# EAGLE design micro-lrs (EAGLE 7.2.0)
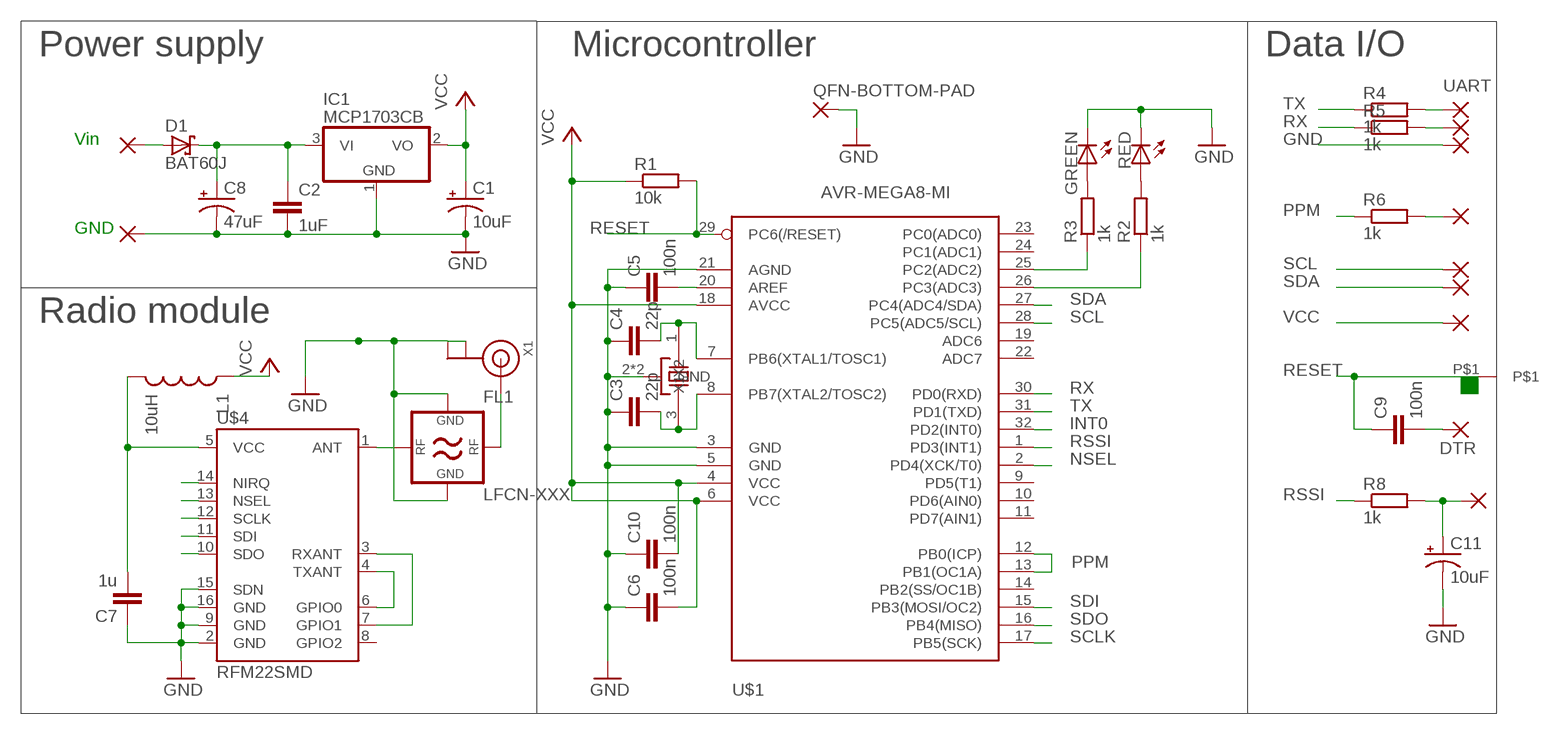
[diagram p0: schematic, sheet 1]

## Parts
+5V  SMD2  [SMD1,27-2,54]
C1  10uF  CAP_POL1206  [EIA3216]
C2  1uF  C-EUC0805K  [C0805K]
C3  22p  C-EUC0603K  [C0603K]
C4  22p  C-EUC0603K  [C0603K]
C5  100n  C-EUC0603K  [C0603K]
C6  100n  C-EUC0603K  [C0603K]
C7  1u  C-EUC0805K  [C0805K]
C8  47uF  CAP_POL3528  [EIA3528]
C9  100n  C-EUC0603K  [C0603K]
C10  100n  C-EUC0603K  [C0603K]
C11  10uF  CAP_POL1206  [EIA3216]
D1  BAT60J  [SOD323_ST]
DTR  SMD2  [SMD1,27-2,54]
FL1  LFCN-XXX  [FV1206]
GND  SMD2  [SMD1,27-2,54]
IC1  MCP1703CB  [SOT23]
L1  10uH  INDUCTOR0805  [0805]
LED1  GREEN  LEDCHIPLED_0603  [CHIPLED_0603]
LED2  RED  LEDCHIPLED_0603  [CHIPLED_0603]
PPM  SMD2  [SMD1,27-2,54]
PPM1  SMD2  [SMD1,27-2,54]
QFN-BOTTOM-PAD  QFN-PAD  [SMD100X100]
R1  10k  R-EU_R0603  [R0603]
R2  1k  R-EU_R0603  [R0603]
R3  1k  R-EU_R0603  [R0603]
R4  1k  R-EU_R0603  [R0603]
R5  1k  R-EU_R0603  [R0603]
R6  1k  R-EU_R0603  [R0603]
R8  1k  R-EU_R0603  [R0603]
RSSI  SMD2  [SMD1,27-2,54]
RX  SMD2  [SMD1,27-2,54]
SCL  SMD2  [SMD1,27-2,54]
SDA  SMD2  [SMD1,27-2,54]
TX  SMD2  [SMD1,27-2,54]
U$1  AVR-MEGA8-MI  [MLF32]
U$2  CTS_32X25_SMD  [CTS_32X25]
U$3  PAD75X60  [PAD75X60]
U$4  RFM22SMD  [RFM22-XXX-S2]
UART-GND  SMD2  [SMD1,27-2,54]
X1  ANTENNA_U.FL  [U.FL]

## Nets
ANT-PAD: FL1.1(IO1) U$4.1(ANT)
AREF: C5.2 U$1.20(AREF)
DTR: C9.2 DTR.1(P)
GND: C1.C(-) C2.2 C3.1 C4.1 C5.1 C6.1 C7.1 C8.C(-) C10.1 C11.C(-) FL1.3(GND2) FL1.4(GND1) GND.1(P) IC1.1(GND) LED1.C LED2.C QFN-BOTTOM-PAD.P$2(P) U$1.3(GND) U$1.5(GND) U$1.21(AGND) U$4.2(GND) U$4.9(GND) U$4.15(SDN) U$4.16(GND) UART-GND.1(P) X1.1(GND) X1.2(GND)
INT0: U$1.32(PD2(INT0)) U$4.14(NIRQ)
N$2: C4.2 U$1.7(PB6(XTAL1/TOSC1)) U$2.1(X1)
N$3: C3.2 U$1.8(PB7(XTAL2/TOSC2)) U$2.3(X2)
N$4: R3.1 U$1.25(PC2(ADC2))
N$5: R2.1 U$1.26(PC3(ADC3))
N$7: LED1.A R3.2
N$8: LED2.A R2.2
N$12: FL1.2(IO2) X1.3(SIGNAL)
N$16: U$4.4(TXANT) U$4.6(GPIO0)
N$17: U$4.3(RXANT) U$4.7(GPIO1)
NSEL: U$1.2(PD4(XCK/T0)) U$4.13(NSEL)
PPM: R6.1 U$1.12(PB0(ICP)) U$1.13(PB1(OC1A))
PPMPAD: PPM.1(P) R6.2
RESET: C9.1 R1.2 U$1.29(PC6(/RESET)) U$3.P$1
RSSI: R8.1 U$1.1(PD3(INT1))
RSSIPAD: C11.A(+) R8.2 RSSI.1(P)
RX: R5.1 U$1.30(PD0(RXD))
RXPAD: R5.2 RX.1(P)
SCL: SCL.1(P) U$1.28(PC5(ADC5/SCL))
SCLK: U$1.17(PB5(SCK)) U$4.12(SCLK)
SDA: SDA.1(P) U$1.27(PC4(ADC4/SDA))
SDI: U$1.15(PB3(MOSI/OC2)) U$4.11(SDI)
SDO: U$1.16(PB4(MISO)) U$4.10(SDO)
TX: R4.1 U$1.31(PD1(TXD))
TXPAD: R4.2 TX.1(P)
VCC: C1.A(+) C6.2 C10.2 IC1.2(VO) L1.1 PPM1.1(P) R1.1 U$1.4(VCC) U$1.6(VCC) U$1.18(AVCC)
VCC-RADIO: C7.2 L1.2 U$4.5(VCC)
VIN: C2.1 C8.A(+) D1.C IC1.3(VI)
VIN-BEFORE-DIODE: +5V.1(P) D1.A
Unconnected: U$1.9(PD5(T1)) U$1.10(PD6(AIN0)) U$1.11(PD7(AIN1)) U$1.14(PB2(SS/OC1B)) U$1.19(ADC6) U$1.22(ADC7) U$1.23(PC0(ADC0)) U$1.24(PC1(ADC1)) U$4.8(GPIO2)

## Notes on the sheet
- Power supply | Microcontroller | Data I/O
- UART
- Vin
- GND
- Radio module

## Power pins joined to a net without a drawn wire
GND: U$2.2(GND) U$2.4(GND)

## Library data of the parts
+5V DTR GND PPM PPM1 RSSI RX SCL SDA TX UART-GND = wirepad:SMD2: SMD PAD
C1 C8 C11 = SparkFun:CAP_POL: Capacitor Polarized These are standard SMD and PTH capacitors. Normally 10uF, 47uF, and 100uF in electrolytic and tantalum varieties. Always verify the external diameter of the through hole cap, it varies with capacity, voltage, and manufacturer. The EIA devices should be standard.
C2-C7 C9 C10 = resistor:C-EU: CAPACITOR, European symbol
D1 = diode:BAT60J: Schottky barrier diode Source: www.st.com, BAT60J.pdf
FL1 = mini-circuits:LFCN-XXX: CERAMIC LOW PASS FILTER
IC1 = linear:MCP1703: 250 mA, 16V, Low Quiescent Current LDO Regulator Source: http://ww1.microchip.com/downloads/en/DeviceDoc/22049b.pdf
L1 = SparkFun:INDUCTOR: Inductors Basic Inductor/Choke - 0603 and 1206. Footprints are not proven and vary greatly between part numbers.
LED1 LED2 = led:LED: LED OSRAM: - CHIPLED LG R971, LG N971, LY N971, LG Q971, LY Q971, LO R971, LY R971 LH N974, LH R974 LS Q976, LO Q976, LY Q976 LO Q996 - Hyper CHIPLED LW Q18S LB Q993, LB Q99A, LB R99A - SideLED LS A670, LO A670, LY A670, LG A670, LP A670 LB A673, LV A673, LT A673, LW A673 LH A674 LY A675 LS A676, LA A676, LO A676, LY A676, LW A676 LS A679, LY A679, LG A679 - Hyper Micro SIDELED® LS Y876, LA Y876, LO Y876, LY Y876 LT Y87S - SmartLED LW L88C, LW L88S LB L89C, LB L89S, LG L890 LS L89K, LO L89K, LY L89K LS L896, LA L896, LO L896, LY L896 - TOPLED LS T670, LO T670, LY T670, LG T670, LP T670 LSG T670, LSP T670, LSY T670, LOP T670, LYG T670 LG T671, LOG T671, LSG T671 LB T673, LV T673, LT T673, LW T673 LH T674 LS T676, LA T676, LO T676, LY T676, LB T676, LH T676, LSB T676, LW T676 LB T67C, LV T67C, LT T67C, LS T67K, LO T67K, LY T67K, LW E67C LS E67B, LA E67B, LO E67B, LY E67B, LB E67C, LV E67C, LT E67C LW T67C LS T679, LY T679, LG T679 LS T770, LO T770, LY T770, LG T770, LP T770 LB T773, LV T773, LT T773, LW T773 LH T774 LS E675, LA E675, LY E675, LS T675 LS T776, LA T776, LO T776, LY T776, LB T776 LHGB T686 LT T68C, LB T68C - Hyper Mini TOPLED® LB M676 - Mini TOPLED Santana® LG M470 LS M47K, LO M47K, LY M47K Source: http://www.osram.convergy.de - LUMILED® LXK2-PW12-R00, LXK2-PW12-S00, LXK2-PW14-U00, LXK2-PW14-V00 LXK2-PM12-R00, LXK2-PM12-S00, LXK2-PM14-U00 LXK2-PE12-Q00, LXK2-PE12-R00, LXK2-PE12-S00, LXK2-PE14-T00, LXK2-PE14-U00 LXK2-PB12-K00, LXK2-PB12-L00, LXK2-PB12-M00, LXK2-PB14-N00, LXK2-PB14-P00, LXK2-PB14-Q00 LXK2-PR12-L00, LXK2-PR12-M00, LXK2-PR14-Q00, LXK2-PR14-R00 LXK2-PD12-Q00, LXK2-PD12-R00, LXK2-PD12-S00 LXK2-PH12-R00, LXK2-PH12-S00 LXK2-PL12-P00, LXK2-PL12-Q00, LXK2-PL12-R00 Source: www.luxeon.com
QFN-BOTTOM-PAD = wirepad2:QFN-PAD: SMD PAD
R1-R6 R8 = resistor:R-EU_: RESISTOR, European symbol
U$1 = SparkFun:AVR-MEGA8: MICROCONTROLLER 8 Kbytes FLASH 1 kbytes SRAM 512 bytes EEPROM USART 6-channel 10 bit ADC 2-channel 8 bit ADC
U$2 = cts_crystal:CTS_32X25_SMD
U$3 = moje-pady:PAD75X60
U$4 = SparkFun-RF:RFM22: The RFM22 is a low-power, low cost radio that is capable of operating in the 434MHz and 900MHz open bands. It's frequency is software defined and there are some very good libraries written for it.
X1 = adafruit:ANTENNA_U.FL: U.FL Antenna Connector

## Board
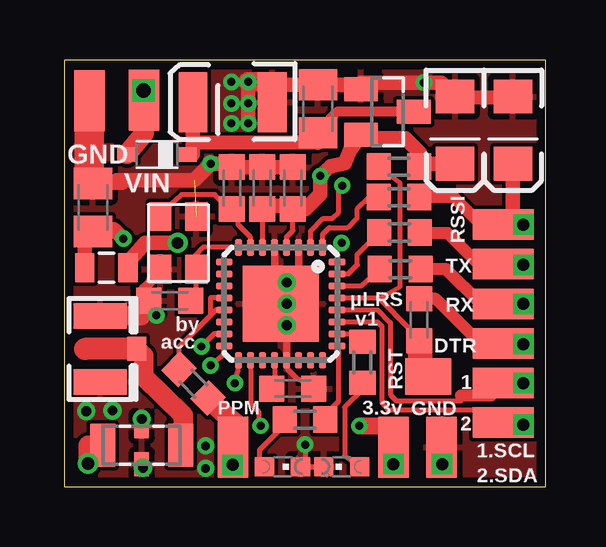
[diagram p1: board, top side]
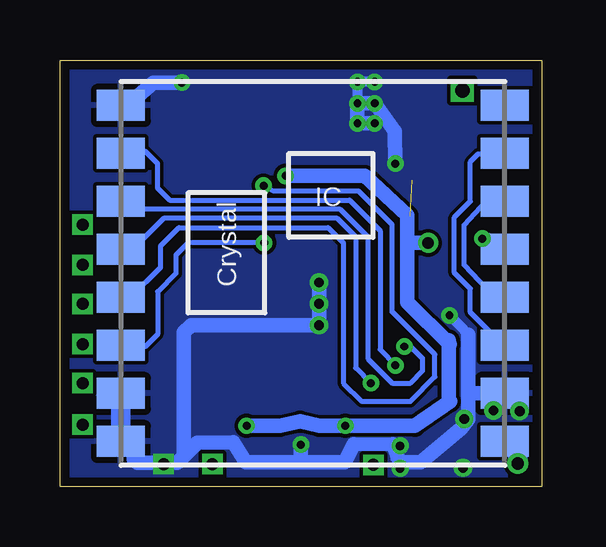
[diagram p2: board, bottom side, seen from below]

Size 20.07 x 17.78 mm. Coordinates in mm from the lower left corner, seen from the top.
Outline: 0,0 20.07,0 20.07,17.78 0,17.78 0,0
Copper layers (1*16): Top 0.0356mm / dielectric 1.5011mm / Bottom 0.0356mm
Design rules "oshpark-design-rules *": minimum track width 6mil, minimum drill 13mil, track to track 6mil, track to pad 6mil, pad to pad 6mil, via to via 6mil, smd to smd 6mil, copper to edge 15mil, drill to drill 6mil, minimum pad ring 7mil, minimum via ring 7mil, stop-mask expansion 3mil, vias tented up to drill 25mil, thermal gap 10mil

### Footprints (pad centres in the part's own frame; a part is rotated, then mirrored left to right if it is on the bottom)
SMD1,27-2,54 = smd 1.27 x 2.54: 1 0,0
EIA3216 = smd 1.4 x 1.6: A 1.4,0; C -1.4,0
C0805K = smd 1.3 x 1.6: 1 -1,0; 2 1,0
C0603K = smd 1.05 x 1.08: 1 -0.875,0; 2 0.875,0
EIA3528 = smd 1.2 x 2.5: A 1.65,0; C -1.65,0
SOD323_ST = smd 0.8 x 0.6: A 1.25,0; C -1.25,0
FV1206 = smd 1.04 x 1.8: 1 -1.625,0; 2 1.625,0 | smd 0.6 x 1: 3 0,0.8; 4 0,-0.8
SOT23 = smd 1 x 1.4: 1 -0.95,-1.1; 2 0.95,-1.1; 3 0,1.1
0805 = smd 0.8 x 1.2: 1 -0.9,0; 2 0.9,0
CHIPLED_0603 = smd 0.8 x 0.8: A 0,-0.75; C 0,0.75
SMD100X100 = smd 3.175 x 3.175: P$2 0,0
R0603 = smd 1 x 1.1: 1 -0.85,0; 2 0.85,0
MLF32 = smd 0.7 x 0.3: 1 -2.35,1.75; 2 -2.35,1.25; 3 -2.35,0.75; 4 -2.35,0.25; 5 -2.35,-0.25; 6 -2.35,-0.75; 7 -2.35,-1.25; 8 -2.35,-1.75; 17 2.35,-1.75; 18 2.35,-1.25; 19 2.35,-0.75; 20 2.35,-0.25; 21 2.35,0.25; 22 2.35,0.75; 23 2.35,1.25; 24 2.35,1.75 | smd 0.3 x 0.7: 9 -1.75,-2.35; 10 -1.25,-2.35; 11 -0.75,-2.35; 12 -0.25,-2.35; 13 0.25,-2.35; 14 0.75,-2.35; 15 1.25,-2.35; 16 1.75,-2.35; 25 1.75,2.35; 26 1.25,2.35; 27 0.75,2.35; 28 0.25,2.35; 29 -0.25,2.35; 30 -0.75,2.35; 31 -1.25,2.35; 32 -1.75,2.35
CTS_32X25 = smd 1.2 x 0.9: 1 -1.1,-0.7; 2 1.1,-0.7; 3 1.1,0.8; 4 -1.1,0.8
PAD75X60 = smd 1.905 x 1.524: P$1 0,0
RFM22-XXX-S2 = smd 2 x 1.3: 1 -8,7; 2 -8,5; 3 -8,3; 4 -8,1; 5 -8,-1; 6 -8,-3; 7 -8,-5; 8 -8,-7; 9 8,-7; 10 8,-5; 11 8,-3; 12 8,-1; 13 8,1; 14 8,3; 15 8,5; 16 8,7
U.FL = smd 2.2 x 1.05: 1 0,1.375; 2 0,-1.375 | smd 0.8 x 1: 3 1.525,0

### Placement (x,y rotation side)
+5V  3.33,16.1 180 top
C1  16.28,14.86 270 top
C2  10.57,15.75 90 top
C3  4.39,7.75 0 top
C4  6.99,12.45 270 top
C5  9.53,4.09 180 top
C6  9.53,12.45 270 top
C7  1.19,11.63 270 top
C8  7.01,16.03 180 top
C9  14.78,6.96 90 top
C10  8.26,12.45 270 top
C11  18.69,14.86 270 top
D1  3.86,13.84 180 top
DTR  18.29,5.97 90 top
FL1  3.23,1.73 0 top
GND  1.04,16.08 180 top
IC1  13.46,15.62 270 top
L1  1.75,9.12 180 top
LED1  9.09,0.84 270 top
LED2  11.56,0.84 90 top
PPM  7.04,1.65 180 top
PPM1  13.72,1.65 0 top
QFN-BOTTOM-PAD  9.02,7.62 0 top
R1  13.94,13.34 180 top
R2  12.42,5.18 270 top
R3  10.03,2.79 180 top
R4  13.97,10.59 0 top
R5  14,9.07 0 top
R6  5.38,4.29 315 top
R8  13.94,12.06 0 top
RSSI  18.29,10.92 90 top
RX  18.29,7.62 90 top
SCL  18.29,4.32 90 top
SDA  18.29,2.67 90 top
TX  18.29,9.27 90 top
U$1  9.02,7.62 270 top
U$2  4.7,10.16 270 top
U$3  15.16,4.6 0 top
U$4  9.53,8.89 180 bottom
UART-GND  15.72,1.65 180 top
X1  1.5,5.74 0 top

### Tracks (layer width: path | path; a pad name or v marks a point on that pad's centre or on a via)
ANT-PAD  (via drill 0.51)
  Top 0.813: FL1.1 0.99,1.73 v0.99,0.96
  Bottom 0.406: 1.62,1.65 U$4.1
  Bottom 0.813: v0.99,0.96 0.99,1.65 1.62,1.65
AREF
  Top 0.203: U$1.20 8.77,4.21 C5.2
DTR  (via drill 0.5)
  Top 0.406: DTR.1 19.13,5.97 v19.13,5.94
  Top 0.508: DTR.1 17.32,5.97 15.47,7.82 14.9,7.82 C9.2
GND  (via drill 0.33, 0.36, 0.41, 0.5)  (1 unrouted)
  Top 0.203: v3.83,7.14 3.83,7.22 C3.1 3.3,7.76 3.3,8.26 | LED1.C 10.16,0.84 10.06,0.94 | U$1.21 9.29,4.91 9.68,4.52 9.97,4.39 C5.1 | 8.77,7.62 QFN-BOTTOM-PAD.P$2 | U$2.2 4,8.95 | LED1.C LED2.C | v10.03,1.75 10.03,1.03 LED1.C
  Top 0.305: 8.77,7.62 U$1.5 | U$1.3 9.77,7.62 v9.27,7.62 QFN-BOTTOM-PAD.P$2 v9.27,7.62 U$1.21
  Top 0.406: UART-GND.1 15.75,1.65 v15.75,0.94 | 4,8.95 3.3,8.26 | 3.2,7.12 v3.83,7.14
  Top 0.61: C6.1 C10.1 C4.1 6.84,13.46 v6.1,13.46 5.41,12.78 2.18,12.78 2.4,12.66 C7.1 | 12.39,16.57 IC1.1 | 8.66,16.75 C2.2 12.36,16.75 IC1.1 | 8.66,16.75 C8.C | IC1.1 12.36,16.84 v14.99,16.84 15.7,16.84 C1.C 16.28,16.18 C11.C | 8.54,16.87 8.66,16.75 | v7.67,16.87 v7.67,15.14
  Top 0.813: X1.1 3.2,7.12 | 8.54,16.87 v7.67,16.87
  Top 1.219: GND.1 1.04,12.79 C7.1
  Bottom 0.203: 1.6,3.81 U$4.2 2.24,3.89 | 2.97,3.89 3.05,2.82 | 10.03,1.09 10.16,1.02 | 6.2,1.78 6.2,1.14 v5.89,0.76 | v5.89,1.7 6.06,1.65 6.13,1.58
  Bottom 0.406: 3.05,6.33 v3.83,7.14 | v6.96,16.87 v7.67,16.87 v7.67,15.98
  Bottom 0.559: 6.2,1.78 7.82,1.78
  Bottom 0.61: U$4.2 2.97,3.89 | v6.1,13.46 6.12,14.81 v6.96,15.98 v7.67,15.98 v7.67,15.14 v6.96,15.14 | 6.2,1.78 6.13,1.58 5.92,1.02 5.03,1.02 3.38,2.41 3.05,2.82 3.05,6.33 | 7.82,1.78 8.2,1.02 10.16,1.02 12.32,1.02 12.85,1.85 14.35,1.83 14.91,1.27 | v10.03,1.75 10.03,1.09 | v9.27,8.51 v9.27,7.62 v9.27,6.73 14.61,6.73 14.91,6.43 14.91,1.27 | U$4.16 17.16,1.52 16.99,1.52 16.99,1.14 16.84,0.99 15.8,0.99 v15.75,0.94 15.7,0.99 15.19,0.99 14.91,1.27 | v14.99,16.84 16.18,16.84 17.26,15.89 U$4.9
  Bottom 0.813: U$4.16 U$4.15
  other vias: 3.23,2.82 3.28,0.79 0.91,3.15 2.01,3.17
  pour Bottom: -0.38,18.8 20.95,18.8 20.62,-0.84 -0.71,-0.84
  pour Top: -0.38,14.25 0.05,14.25 4.62,14.2 4.62,18.49 6.6,18.49 21.21,18.54 21.21,-0.51 15.06,-0.56 15.06,3.3 12.73,3.35 12.67,-0.48 -0.38,-0.51
INT0  (via drill 0.33)
  Top 0.203: U$1.32 11.37,9.97 v11.56,10.16
  Bottom 0.203: 11.56,10.29 v11.56,10.16 14.73,10.16 15.24,9.65 15.24,8.89 16,8.13 16,6.35 16.51,5.84 17.48,5.84 U$4.14
N$2
  Top 0.203: U$2.1 4.06,11.32 4.06,11.43 4.88,12.17 6.27,12.17 6.84,11.57 C4.2 7.24,11.32 7.24,10.92 7.77,10.39 U$1.7
N$3
  Top 0.203: U$1.8 5.78,9.97 5.46,9.65 5.46,9.1 U$2.3 5.5,7.74 C3.2
N$4
  Top 0.203: R3.1 10.88,3.01 11.43,3.56 11.43,5.81 U$1.25
N$5
  Top 0.203: U$1.26 12.11,6.37 R2.1
N$7
  Top 0.203: R3.2 9.18,2.58 8.13,1.52 8.13,0.95 LED1.A
N$8
  Top 0.203: 12.14,0.93 LED2.A 11.68,1.28 11.68,3.3 12.47,4.09 R2.2
N$12
  Top 0.406: X1.3 3.3,5.74 | 4.95,1.83 FL1.2
  Top 0.813: 4.95,1.83 4.95,2.97 3.3,4.57 3.3,5.46 X1.3 3,5.74
  Top 0.914: 3,5.74 0.86,5.74
N$16
  Bottom 0.203: U$4.4 1.95,7.89 3.23,9.25 3.23,10.9 2.31,11.89 U$4.6
N$17
  Bottom 0.203: U$4.3 1.6,5.89 2.97,7.26 2.97,8.26 3.63,8.91 3.63,11.23 2.97,11.89 2.97,13.54 2.64,13.87 1.55,13.87 U$4.7
NSEL  (via drill 0.33)
  Top 0.203: U$1.2 10.27,10.65 10.79,11.18 11.18,11.18 11.43,11.43 11.43,12.39 v11.58,12.55
  Bottom 0.203: U$4.13 17.13,7.89 15.88,9.14 15.88,10.03 15.11,10.79 8.89,10.79 8.26,10.16 8.26,4.32 7.49,3.56 5.46,3.56 4.45,4.57 4.45,5.51 6.22,7.29 6.22,10.92 7.62,12.32 11.18,12.32 v11.58,12.55
PPM
  Top 0.203: U$1.13 6.4,7.37 6.35,7.39 6.08,7.12 | U$1.12 6.08,7.87 6.08,7.12 | R6.1 4.78,5.83 6.08,7.12
PPMPAD  (via drill 0.5)
  Top 0.203: 7.25,2.55 PPM.1
  Top 0.406: PPM.1 v7.01,0.91
  Top 0.813: 7.25,2.55 6.54,3.14 R6.2
RESET
  Top 0.203: R1.2 13.97,12.68 13.97,8.31 13.15,7.83 | U$1.29 13.11,7.87 13.15,7.83 | 13.15,7.83 14.35,6.6 14.35,6.29 C9.1
  Top 1.016: U$3.P$1 14.88,4.66 C9.1
RSSI
  Top 0.203: R8.1 12.7,12.06 12.19,11.56 12.19,11.18 11.81,10.79 11.05,10.79 10.77,10.51 U$1.1
RSSIPAD  (via drill 0.5)
  Top 0.406: v19.13,10.92 19.05,10.92 | RSSI.1 v19.13,10.92 | v19.13,10.92 19.1,10.92
  Top 0.508: RSSI.1 17.37,10.92 16.23,12.06 R8.2
  Top 0.61: C11.A 18.69,11.07 v19.13,10.92
RX
  Top 0.203: U$1.30 12.37,8.37 R5.1
RXPAD  (via drill 0.5)
  Top 0.406: RX.1 v19.13,7.62
  Top 0.508: RX.1 17.35,7.62 15.9,9.07 R5.2
SCL  (via drill 0.5)
  Top 0.203: U$1.28 13.05,7.37 13.59,6.83 13.59,3.83 13.84,3.58 16.54,3.58 16.54,3.81
  Top 0.406: SCL.1 v19.13,4.32
  Top 0.508: 16.54,3.81 17.78,3.81 SCL.1
SCLK  (via drill 0.33)
  Top 0.203: v7.11,4.32 7.24,4.86 U$1.17
  Bottom 0.203: 7.11,4.45 v7.11,4.32 7.75,4.95 7.75,10.41 8.51,11.18 15.75,11.18 17.02,9.91 | 17.02,9.91 16.64,9.91 16.64,10.41 | 17.02,9.91 17.51,9.91 U$4.12
SDA  (via drill 0.5)
  Top 0.203: 18.16,2.54 17.14,2.54 SDA.1 17.75,3.2 13.49,3.2 13.23,3.5 13.23,6.68 13.04,6.87 U$1.27
  Top 0.406: SDA.1 19.13,2.67 v19.13,2.59
SDI  (via drill 0.33)
  Top 0.203: U$1.15 6.24,6.37 v5.71,5.84
  Bottom 0.203: U$4.11 17.1,11.56 8.38,11.56 7.24,10.41 7.24,5.33 6.22,4.32 5.46,4.32 4.95,4.83 4.95,5.33 5.46,5.84 v5.71,5.84
SDO  (via drill 0.33)
  Top 0.203: U$1.16 6.67,5.52 v6.1,5.05
  Bottom 0.203: v6.1,5.05 6.73,5.71 6.73,10.67 8,11.94 15.49,11.94 16,12.45 16,13.46 16.51,13.97 17.45,13.97 U$4.10
TX
  Top 0.203: U$1.31 11.84,8.87 12.22,9.25 12.22,9.69 R4.1
TXPAD  (via drill 0.5)
  Top 0.406: TX.1 19.13,9.27 v19.13,9.25
  Top 0.508: TX.1 17.27,9.27 15.98,10.57 14.85,10.57 R4.2
VCC  (via drill 0.33, 0.48, 0.5)
  Top 0.203: 8.27,11.71 C10.2 | U$1.6 8.27,11.46 C10.2 | 8.51,11.7 C10.2 | U$1.4 9.27,10.41 9.53,10.67 C6.2 9.4,11.7 | 13.49,2.54 13.54,2.59 PPM1.1 | U$1.18 7.77,3.46 8.1,3.13 8.1,2.62 v8.18,2.54 | L1.1 2.63,9.31
  Top 0.406: PPM1.1 13.41,1.65 v13.72,0.94
  Top 0.61: 8.51,11.7 9.4,11.7 | C6.2 10.05,11.57 10.67,12.19 v10.67,12.95 11.1,13.36 11.68,13.49 11.89,13.99 IC1.2 12.5,14.53 14.2,14.53 14.82,13.91 14.82,13.46 | 2.63,9.31 3.38,10.16 v4.72,10.16 | C1.A 14.82,13.46 | 14.82,13.46 R1.1
  Top 0.711: v12.29,2.54 13.49,2.54
  Bottom 0.203: 3.81,3.56 3.86,3.61 | 3.83,5.94 3.86,6.1 | 5.51,10.16 5.59,10.24
  Bottom 0.61: v10.67,12.95 7.37,12.95 5.59,11.3 5.59,10.24 5.59,7.7 3.83,5.94 | 3.81,3.56 5.28,2.54 v8.18,2.54 9.27,2.54 10.06,2.72 10.9,2.54 v12.29,2.54 | 3.86,3.61 3.86,6.1 | v4.72,10.16 5.51,10.16
VCC-RADIO  (via drill 0.33)
  Top 0.61: L1.2 0.85,10.39 C7.2 2.07,10.73 v2.46,10.34
  Bottom 0.203: 1.79,10.16 U$4.5
  Bottom 0.61: v2.46,10.34 1.79,10.16
VIN
  Top 0.406: IC1.3 11.35,15.62 C2.1 10.54,14.33
  Top 0.584: 10.54,14.33 5.36,14.33
  Top 0.61: D1.C 5.36,13.84 5.36,14.33 C8.A
VIN-BEFORE-DIODE  (via drill 0.6)
  Top 0.203: 3.09,15.51 +5V.1 | v3.3,16.51 3.3,15.54 3.33,15.52
  Top 0.61: 3.33,14.74 3.33,15.52 +5V.1
  Top 0.813: D1.A 3.33,14.74

### Text on the board
tPlace: GND | VIN | RSSI | TX | µLRS | by | v1 | RX | acc | RST | DTR | PPM | 3.3v | GND | 1 | 2 | 1.SCL | 2.SDA